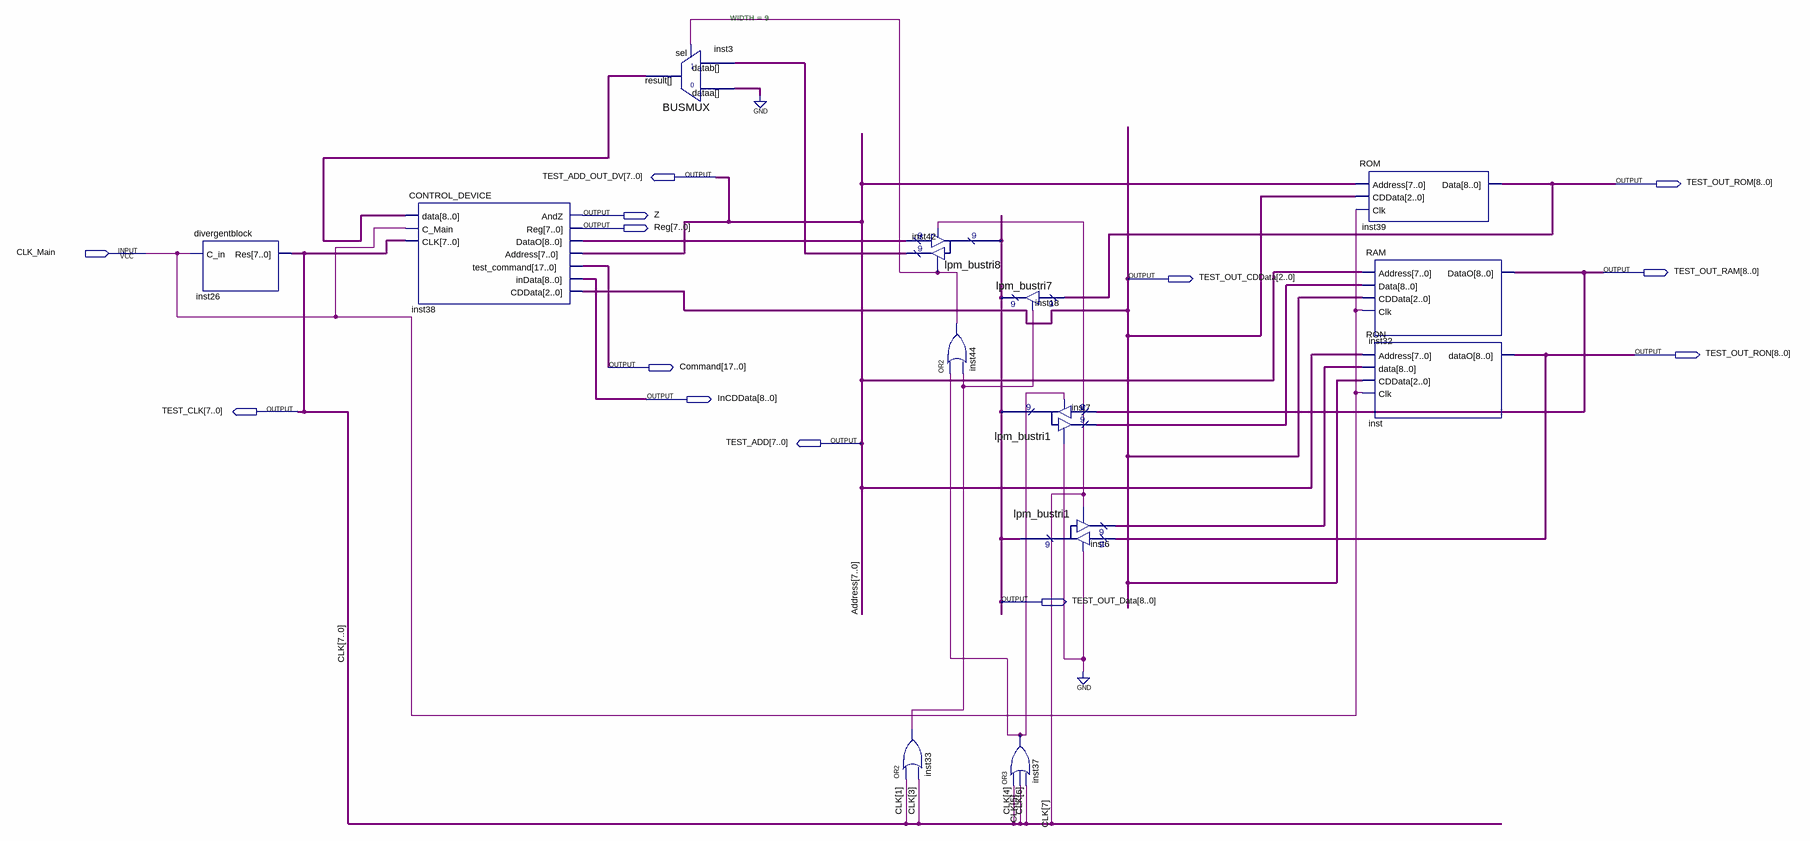
[diagram p0: schematic sheet]
// Quartus schematic LAB4_Start.bdf as structural Verilog: 13 symbols, 13 pins
module LAB4_Start (
  input  CLK_Main,
  output [7:0] TEST_ADD_OUT_DV,
  output [8:0] TEST_OUT_ROM,
  output Z,
  output [7:0] Reg,
  output [8:0] TEST_OUT_RAM,
  output [2:0] TEST_OUT_CDData,
  output [8:0] TEST_OUT_RON,
  output [17:0] Command,
  output [8:0] InCDData,
  output [7:0] TEST_CLK,
  output [7:0] TEST_ADD,
  output [8:0] TEST_OUT_Data
);

  wire inst33_out, inst37_out, inst44_out;
  wire [8:0] inst3_result, inst6_result, inst7_result, inst38_datao, inst42_result;

  divergentblock inst26 (.C_in(CLK_Main), .Res(TEST_CLK));
  CONTROL_DEVICE inst38 (
    .data(inst3_result), .C_Main(CLK_Main), .CLK(TEST_CLK), .AndZ(Z), .Reg(Reg), .DataO(inst38_datao),
    .Address(TEST_ADD), .test_command(Command), .inData(InCDData), .CDData(TEST_OUT_CDData));
  BUSMUX #(.WIDTH(9)) inst3 (.datab(inst42_result), .sel(inst44_out), .dataa({9{1'b0}}), .result(inst3_result));
  lpm_bustri8 inst42 (
    .enabledt(TEST_CLK[7]), .data(inst38_datao), .enabletr(inst44_out), .result(inst42_result),
    .tridata(TEST_OUT_Data));
  or inst33 (inst33_out, TEST_CLK[1], TEST_CLK[3]);
  or inst44 (inst44_out, inst37_out, inst33_out);
  lpm_bustri7 inst18 (.enabledt(inst33_out), .data(TEST_OUT_ROM), .tridata(TEST_OUT_Data));
  lpm_bustri1 inst7 (
    .enabledt(inst37_out), .data(TEST_OUT_RAM), .enabletr(1'b0), .result(inst7_result),
    .tridata(TEST_OUT_Data));
  or inst37 (inst37_out, TEST_CLK[4], TEST_CLK[5], TEST_CLK[6]);
  lpm_bustri1 inst6 (
    .enabledt(1'b0), .data(TEST_OUT_RON), .enabletr(TEST_CLK[7]), .result(inst6_result),
    .tridata(TEST_OUT_Data));
  ROM inst39 (.Address(TEST_ADD), .CDData(TEST_OUT_CDData), .Clk(CLK_Main), .Data(TEST_OUT_ROM));
  RAM inst32 (.Address(TEST_ADD), .Data(inst7_result), .CDData(TEST_OUT_CDData), .Clk(CLK_Main), .DataO(TEST_OUT_RAM));
  RON inst (.Address(TEST_ADD), .data(inst6_result), .CDData(TEST_OUT_CDData), .Clk(CLK_Main), .dataO(TEST_OUT_RON));

  assign TEST_ADD_OUT_DV = TEST_ADD;

  // Other names for the same wires on the sheet: Address[7:0] = TEST_ADD; CLK[7:0] = TEST_CLK
endmodule
